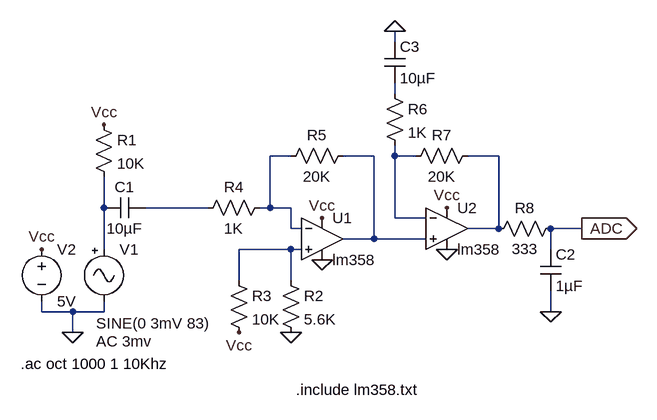
[diagram p0: schematic mic_amp_2.asc]
mic_amp_2.asc, the LTspice schematic file:
Version 4
SHEET 1 976 680
WIRE 576 -224 576 -240
WIRE 576 -144 576 -160
WIRE 416 -48 384 -48
WIRE 544 -48 496 -48
WIRE 576 -48 576 -64
WIRE 608 -48 576 -48
WIRE 736 -48 688 -48
WIRE 128 32 128 -16
WIRE 288 32 192 32
WIRE 384 32 384 -48
WIRE 384 32 368 32
WIRE 416 32 384 32
WIRE 576 48 576 -48
WIRE 624 48 576 48
WIRE 416 64 416 32
WIRE 432 64 416 64
WIRE 736 64 736 -48
WIRE 736 64 688 64
WIRE 864 64 816 64
WIRE 544 80 544 -48
WIRE 544 80 496 80
WIRE 624 80 544 80
WIRE 128 96 128 32
WIRE 416 96 336 96
WIRE 432 96 416 96
WIRE 816 96 816 64
WIRE 336 144 336 96
WIRE 416 144 416 96
WIRE 32 192 32 176
WIRE 80 192 32 192
WIRE 128 192 128 176
WIRE 128 192 80 192
WIRE 816 192 816 160
WIRE 80 224 80 192
FLAG 80 224 0
FLAG 32 96 Vcc
FLAG 128 -96 Vcc
FLAG 464 112 0
FLAG 464 48 Vcc
FLAG 656 96 0
FLAG 656 32 Vcc
FLAG 576 -240 0
FLAG 416 224 0
FLAG 336 224 Vcc
FLAG 864 64 ADC
IOPIN 864 64 Out
FLAG 816 192 0
SYMBOL Misc\\signal 128 80 R0
WINDOW 123 -12 158 Left 2
WINDOW 39 0 0 Left 0
WINDOW 3 -12 130 Left 2
SYMATTR Value2 AC 3mv
SYMATTR Value SINE(0 3mV 83)
SYMATTR InstName V1
SYMBOL voltage 32 80 R0
WINDOW 123 0 0 Left 0
WINDOW 39 0 0 Left 0
SYMATTR InstName V2
SYMATTR Value 5V
SYMBOL cap 192 16 R90
WINDOW 0 0 32 VBottom 2
WINDOW 3 32 32 VTop 2
SYMATTR InstName C1
SYMATTR Value 10µF
SYMBOL res 112 -112 R0
SYMATTR InstName R1
SYMATTR Value 10K
SYMBOL Opamps\\opamp2 464 16 R0
SYMATTR InstName U1
SYMATTR Value lm358
SYMBOL Opamps\\opamp2 656 0 R0
SYMATTR InstName U2
SYMATTR Value lm358
SYMBOL res 560 -160 R0
SYMATTR InstName R6
SYMATTR Value 1K
SYMBOL res 704 -64 R90
WINDOW 0 0 56 VBottom 2
WINDOW 3 32 56 VTop 2
SYMATTR InstName R7
SYMATTR Value 20K
SYMBOL cap 560 -224 R0
SYMATTR InstName C3
SYMATTR Value 10µF
SYMBOL res 400 128 R0
SYMATTR InstName R2
SYMATTR Value 5.6K
SYMBOL res 320 128 R0
SYMATTR InstName R3
SYMATTR Value 10K
SYMBOL res 384 16 R90
WINDOW 0 0 56 VBottom 2
WINDOW 3 32 56 VTop 2
SYMATTR InstName R4
SYMATTR Value 1K
SYMBOL res 512 -64 R90
WINDOW 0 0 56 VBottom 2
WINDOW 3 32 56 VTop 2
SYMATTR InstName R5
SYMATTR Value 20K
SYMBOL res 832 48 R90
WINDOW 0 0 56 VBottom 2
WINDOW 3 32 56 VTop 2
SYMATTR InstName R8
SYMATTR Value 333
SYMBOL cap 800 96 R0
SYMATTR InstName C2
SYMATTR Value 1µF
TEXT 424 312 Left 2 !.include lm358.txt
TEXT 0 272 Left 2 !.ac oct 1000 1 10Khz

The netlist it stands for:
* mic_amp_2.asc
V1 N006 0 SINE(0 3mV 83) AC 3mv
V2 Vcc 0 5V
C1 N007 N006 10µF
R1 Vcc N006 10K
XU1 N008 N002 Vcc 0 N003 lm358  ; pins In+ In- V+ V- OUT
XU2 N003 N004 Vcc 0 N005 lm358  ; pins In+ In- V+ V- OUT
R6 N001 N004 1K
R7 N005 N004 20K
C3 0 N001 10µF
R2 N008 0 5.6K
R3 N008 Vcc 10K
R4 N002 N007 1K
R5 N003 N002 20K
R8 ADC N005 333
C2 ADC 0 1µF
.include lm358.txt
.ac oct 1000 1 10Khz
.backanno
.end